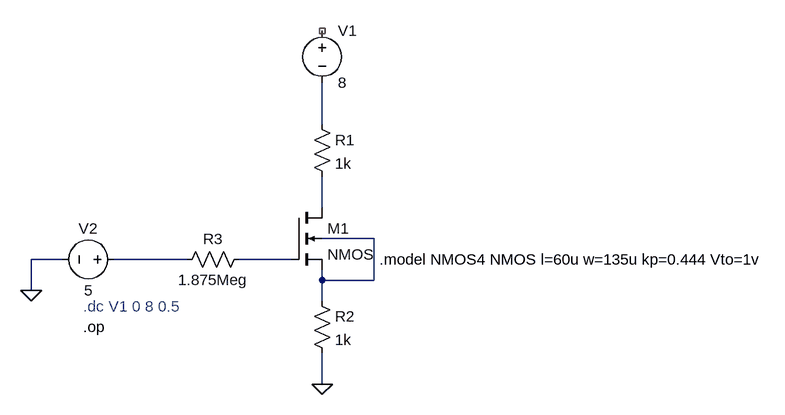
[diagram p0: schematic Simulation3.asc]
Simulation3.asc, the LTspice schematic file:
Version 4.1
SHEET 1 988 680
WIRE 256 144 256 80
WIRE 256 272 256 224
WIRE 336 320 256 320
WIRE -144 352 -192 352
WIRE 48 352 -64 352
WIRE 208 352 128 352
WIRE 256 384 256 368
WIRE 336 384 336 320
WIRE 336 384 256 384
WIRE -192 400 -192 352
WIRE 256 416 256 384
WIRE 256 544 256 496
FLAG 256 544 0
FLAG -192 400 0
SYMBOL res 240 128 R0
SYMATTR InstName R1
SYMATTR Value 1k
SYMBOL nmos4 208 272 R0
SYMATTR InstName M1
SYMBOL voltage 256 -16 R0
WINDOW 123 0 0 Left 0
WINDOW 39 0 0 Left 0
SYMATTR InstName V1
SYMATTR Value 8
SYMBOL res 240 400 R0
SYMATTR InstName R2
SYMATTR Value 1k
SYMBOL res 144 336 R90
WINDOW 0 0 56 VBottom 2
WINDOW 3 32 56 VTop 2
SYMATTR InstName R3
SYMATTR Value 1.875Meg
SYMBOL voltage -48 352 R90
WINDOW 0 -32 56 VBottom 2
WINDOW 3 32 56 VTop 2
WINDOW 123 0 0 Left 0
WINDOW 39 0 0 Left 0
SYMATTR InstName V2
SYMATTR Value 5
TEXT 344 352 Left 2 !.model NMOS4 NMOS l=60u w=135u kp=0.444 Vto=1v
TEXT -112 424 Left 2 ;.dc V1 0 8 0.5
TEXT -112 456 Left 2 !.op

The netlist it stands for:
* Simulation3.asc
R1 N001 N002 1k
M1 N002 N005 N003 N003 NMOS
V1 NC_01 N001 8
R2 N003 0 1k
R3 N005 N004 1.875Meg
V2 N004 0 5
.model NMOS NMOS
.model PMOS PMOS
.lib standard.mos
.model NMOS4 NMOS l=60u w=135u kp=0.444 Vto=1v
* .dc V1 0 8 0.5
.op
.backanno
.end